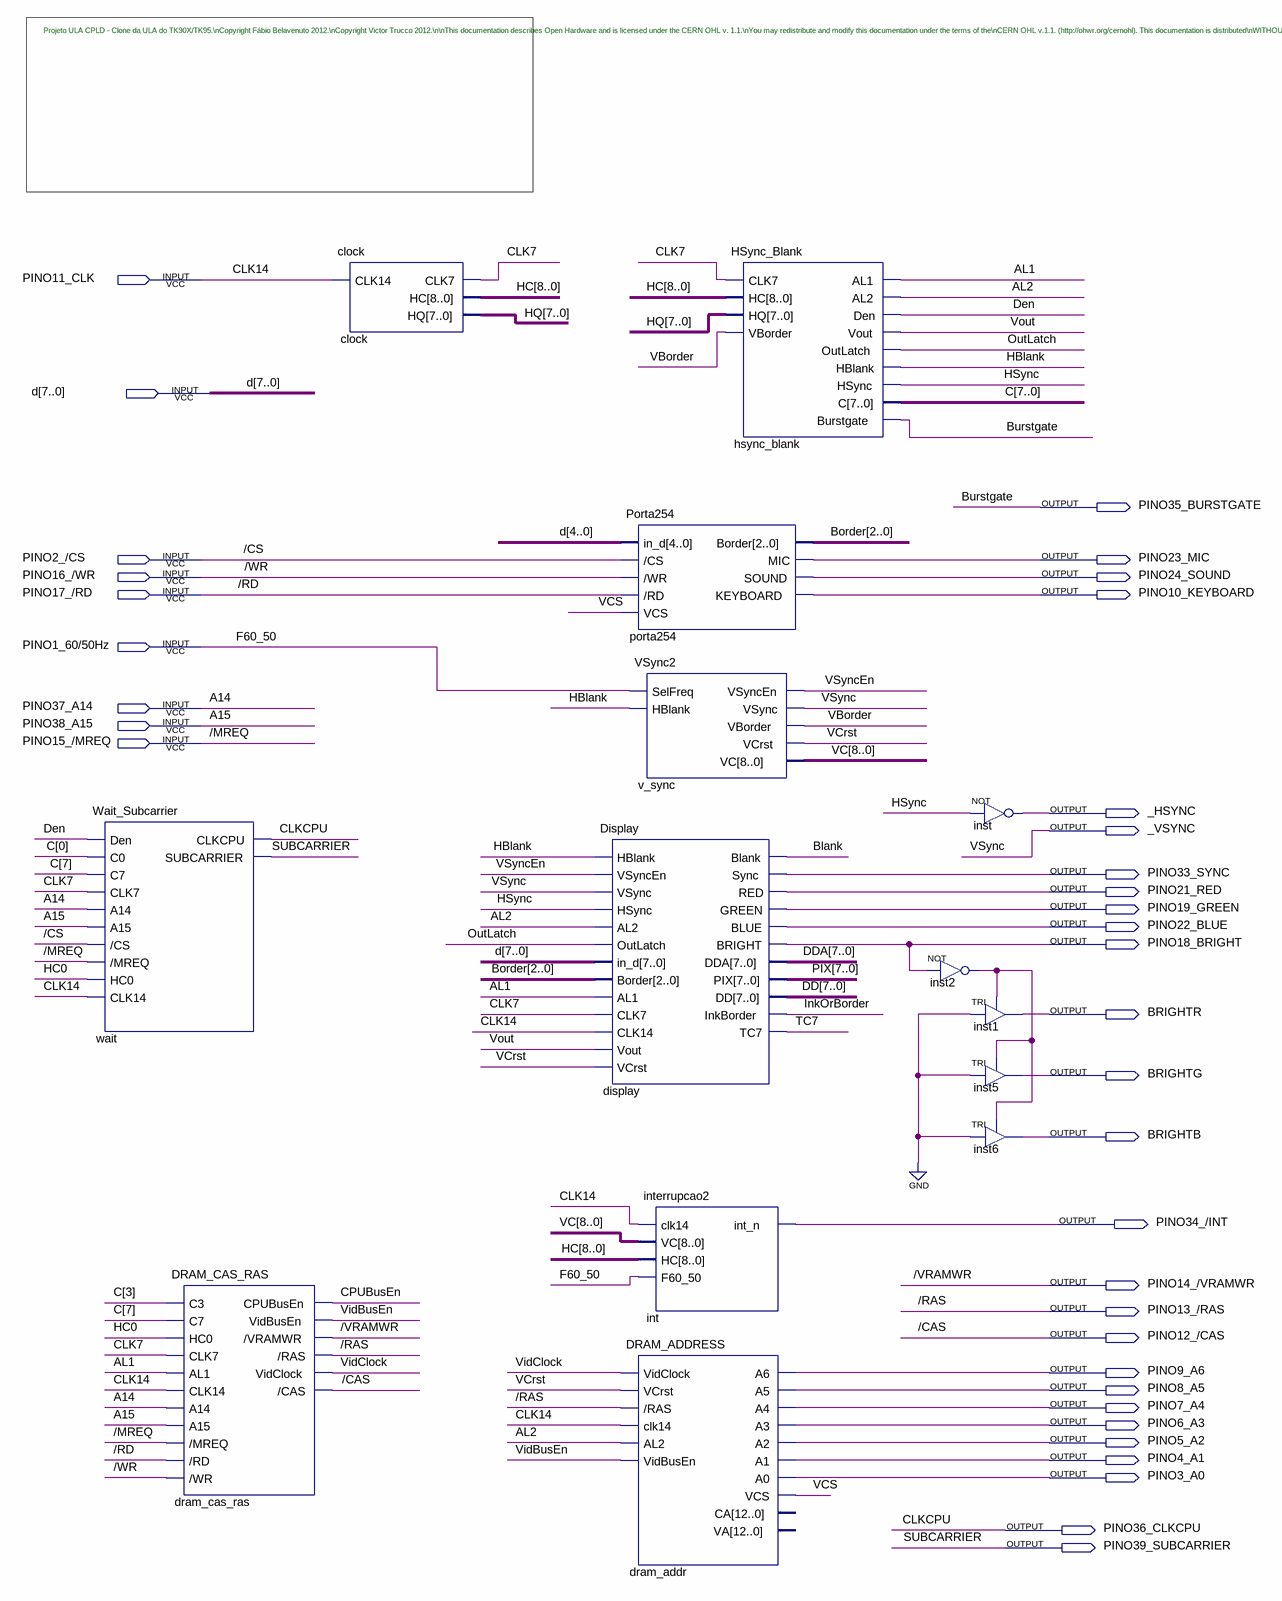
[diagram p0: schematic sheet]
// Quartus schematic ULA.bdf as structural Verilog: 14 symbols, 36 pins
module ULA (
  input  PINO11_CLK,
  input  [7:0] d,
  input  \PINO2_/CS ,
  input  \PINO16_/WR ,
  input  \PINO17_/RD ,
  input  \PINO1_60/50Hz ,
  input  PINO37_A14,
  input  PINO38_A15,
  input  \PINO15_/MREQ ,
  output PINO35_BURSTGATE,
  output PINO23_MIC,
  output PINO24_SOUND,
  output PINO10_KEYBOARD,
  output _HSYNC,
  output _VSYNC,
  output PINO33_SYNC,
  output PINO21_RED,
  output PINO19_GREEN,
  output PINO22_BLUE,
  output PINO18_BRIGHT,
  output BRIGHTR,
  output BRIGHTG,
  output BRIGHTB,
  output \PINO34_/INT ,
  output \PINO14_/VRAMWR ,
  output \PINO13_/RAS ,
  output \PINO12_/CAS ,
  output PINO9_A6,
  output PINO8_A5,
  output PINO7_A4,
  output PINO6_A3,
  output PINO5_A2,
  output PINO4_A1,
  output PINO3_A0,
  output PINO36_CLKCPU,
  output PINO39_SUBCARRIER
);

  wire AL1, AL2, Blank, CLK7, CPUBusEn, Den, HBlank, HSync, InkOrBorder, inst2_out, OutLatch, TC7, VBorder,
       VCrst, VCS, VidBusEn, VidClock, Vout, VSyncEn;
  wire [2:0] Border;
  wire [7:0] C, DD, DDA, HQ, PIX;
  wire [8:0] HC, VC;

  Wait_Subcarrier \wait  (
    .Den(Den), .C0(C[0]), .C7(C[7]), .CLK7(CLK7), .A14(PINO37_A14), .A15(PINO38_A15), .\/CS (\PINO2_/CS ),
    .\/MREQ (\PINO15_/MREQ ), .HC0(HC[0]), .CLK14(PINO11_CLK), .CLKCPU(PINO36_CLKCPU),
    .SUBCARRIER(PINO39_SUBCARRIER));
  DRAM_CAS_RAS dram_cas_ras (
    .C3(C[3]), .C7(C[7]), .HC0(HC[0]), .CLK7(CLK7), .AL1(AL1), .CLK14(PINO11_CLK), .A14(PINO37_A14),
    .A15(PINO38_A15), .\/MREQ (\PINO15_/MREQ ), .\/RD (\PINO17_/RD ), .\/WR (\PINO16_/WR ),
    .CPUBusEn(CPUBusEn), .VidBusEn(VidBusEn), .\/VRAMWR (\PINO14_/VRAMWR ), .\/RAS (\PINO13_/RAS ),
    .VidClock(VidClock), .\/CAS (\PINO12_/CAS ));
  clock clock (.CLK14(PINO11_CLK), .CLK7(CLK7), .HC(HC), .HQ(HQ));
  Display display (
    .HBlank(HBlank), .VSyncEn(VSyncEn), .VSync(_VSYNC), .HSync(HSync), .AL2(AL2), .OutLatch(OutLatch),
    .in_d(d), .Border(Border), .AL1(AL1), .CLK7(CLK7), .CLK14(PINO11_CLK), .Vout(Vout), .VCrst(VCrst),
    .Blank(Blank), .Sync(PINO33_SYNC), .RED(PINO21_RED), .GREEN(PINO19_GREEN), .BLUE(PINO22_BLUE),
    .BRIGHT(PINO18_BRIGHT), .DDA(DDA), .PIX(PIX), .DD(DD), .InkBorder(InkOrBorder), .TC7(TC7));
  Porta254 porta254 (
    .in_d(d[4:0]), .\/WR (\PINO16_/WR ), .\/CS (\PINO2_/CS ), .\/RD (\PINO17_/RD ), .VCS(VCS),
    .Border(Border), .MIC(PINO23_MIC), .SOUND(PINO24_SOUND), .KEYBOARD(PINO10_KEYBOARD));
  VSync2 v_sync (
    .SelFreq(\PINO1_60/50Hz ), .HBlank(HBlank), .VSyncEn(VSyncEn), .VSync(_VSYNC), .VBorder(VBorder),
    .VCrst(VCrst), .VC(VC));
  interrupcao2 \int  (.clk14(PINO11_CLK), .VC(VC), .HC(HC), .F60_50(\PINO1_60/50Hz ), .int_n(\PINO34_/INT ));
  DRAM_ADDRESS dram_addr (
    .VidClock(VidClock), .VCrst(VCrst), .\/RAS (\PINO13_/RAS ), .clk14(PINO11_CLK), .AL2(AL2),
    .VidBusEn(VidBusEn), .A6(PINO9_A6), .A5(PINO8_A5), .A4(PINO7_A4), .A3(PINO6_A3), .A2(PINO5_A2),
    .A1(PINO4_A1), .A0(PINO3_A0), .VCS(VCS));  // open: CA, VA
  HSync_Blank hsync_blank (
    .CLK7(CLK7), .HC(HC), .HQ(HQ), .VBorder(VBorder), .AL1(AL1), .AL2(AL2), .Den(Den), .Vout(Vout),
    .OutLatch(OutLatch), .HBlank(HBlank), .HSync(HSync), .C(C), .Burstgate(PINO35_BURSTGATE));
  not inst2 (inst2_out, PINO18_BRIGHT);
  not inst (_HSYNC, HSync);
  TRI inst1 (.IN(1'b0), .OE(inst2_out), .OUT(BRIGHTR));
  TRI inst5 (.IN(1'b0), .OE(inst2_out), .OUT(BRIGHTG));
  TRI inst6 (.IN(1'b0), .OE(inst2_out), .OUT(BRIGHTB));

  // Other names for the same wires on the sheet: /CAS = \PINO12_/CAS ; /CS = \PINO2_/CS ; /MREQ = \PINO15_/MREQ ;
  //   /RAS = \PINO13_/RAS ; /RD = \PINO17_/RD ; /VRAMWR = \PINO14_/VRAMWR ; /WR = \PINO16_/WR ; VSync = _VSYNC;
  //   A14 = PINO37_A14; A15 = PINO38_A15; Burstgate = PINO35_BURSTGATE; CLK14 = PINO11_CLK; CLKCPU = PINO36_CLKCPU;
  //   F60_50 = \PINO1_60/50Hz ; SUBCARRIER = PINO39_SUBCARRIER

  // Notes on the sheet:
  //   Projeto ULA CPLD - Clone da ULA do TK90X/TK95.\nCopyright Fábio Belavenuto 2012.\nCopyright Victor Trucco 2012.\n\nThis documentation describes Open Hardware and is licensed under the CERN OHL v. 1.1.\nYou may redistribute and modify this documentation under the terms of the\nCERN OHL v.1.1. (http://ohwr.org/cernohl). This documentation is distributed\nWITHOUT ANY EXPRESS OR IMPLIED WARRANTY, INCLUDING OF MERCHANTABILITY,\nSATISFACTORY QUALITY AND FITNESS FOR A PARTICULAR PURPOSE.\nPlease see the CERN OHL v.1.1 for applicable conditions
endmodule
